# EAGLE schematic Eency -- HM-10_v01 (EAGLE 6.4)
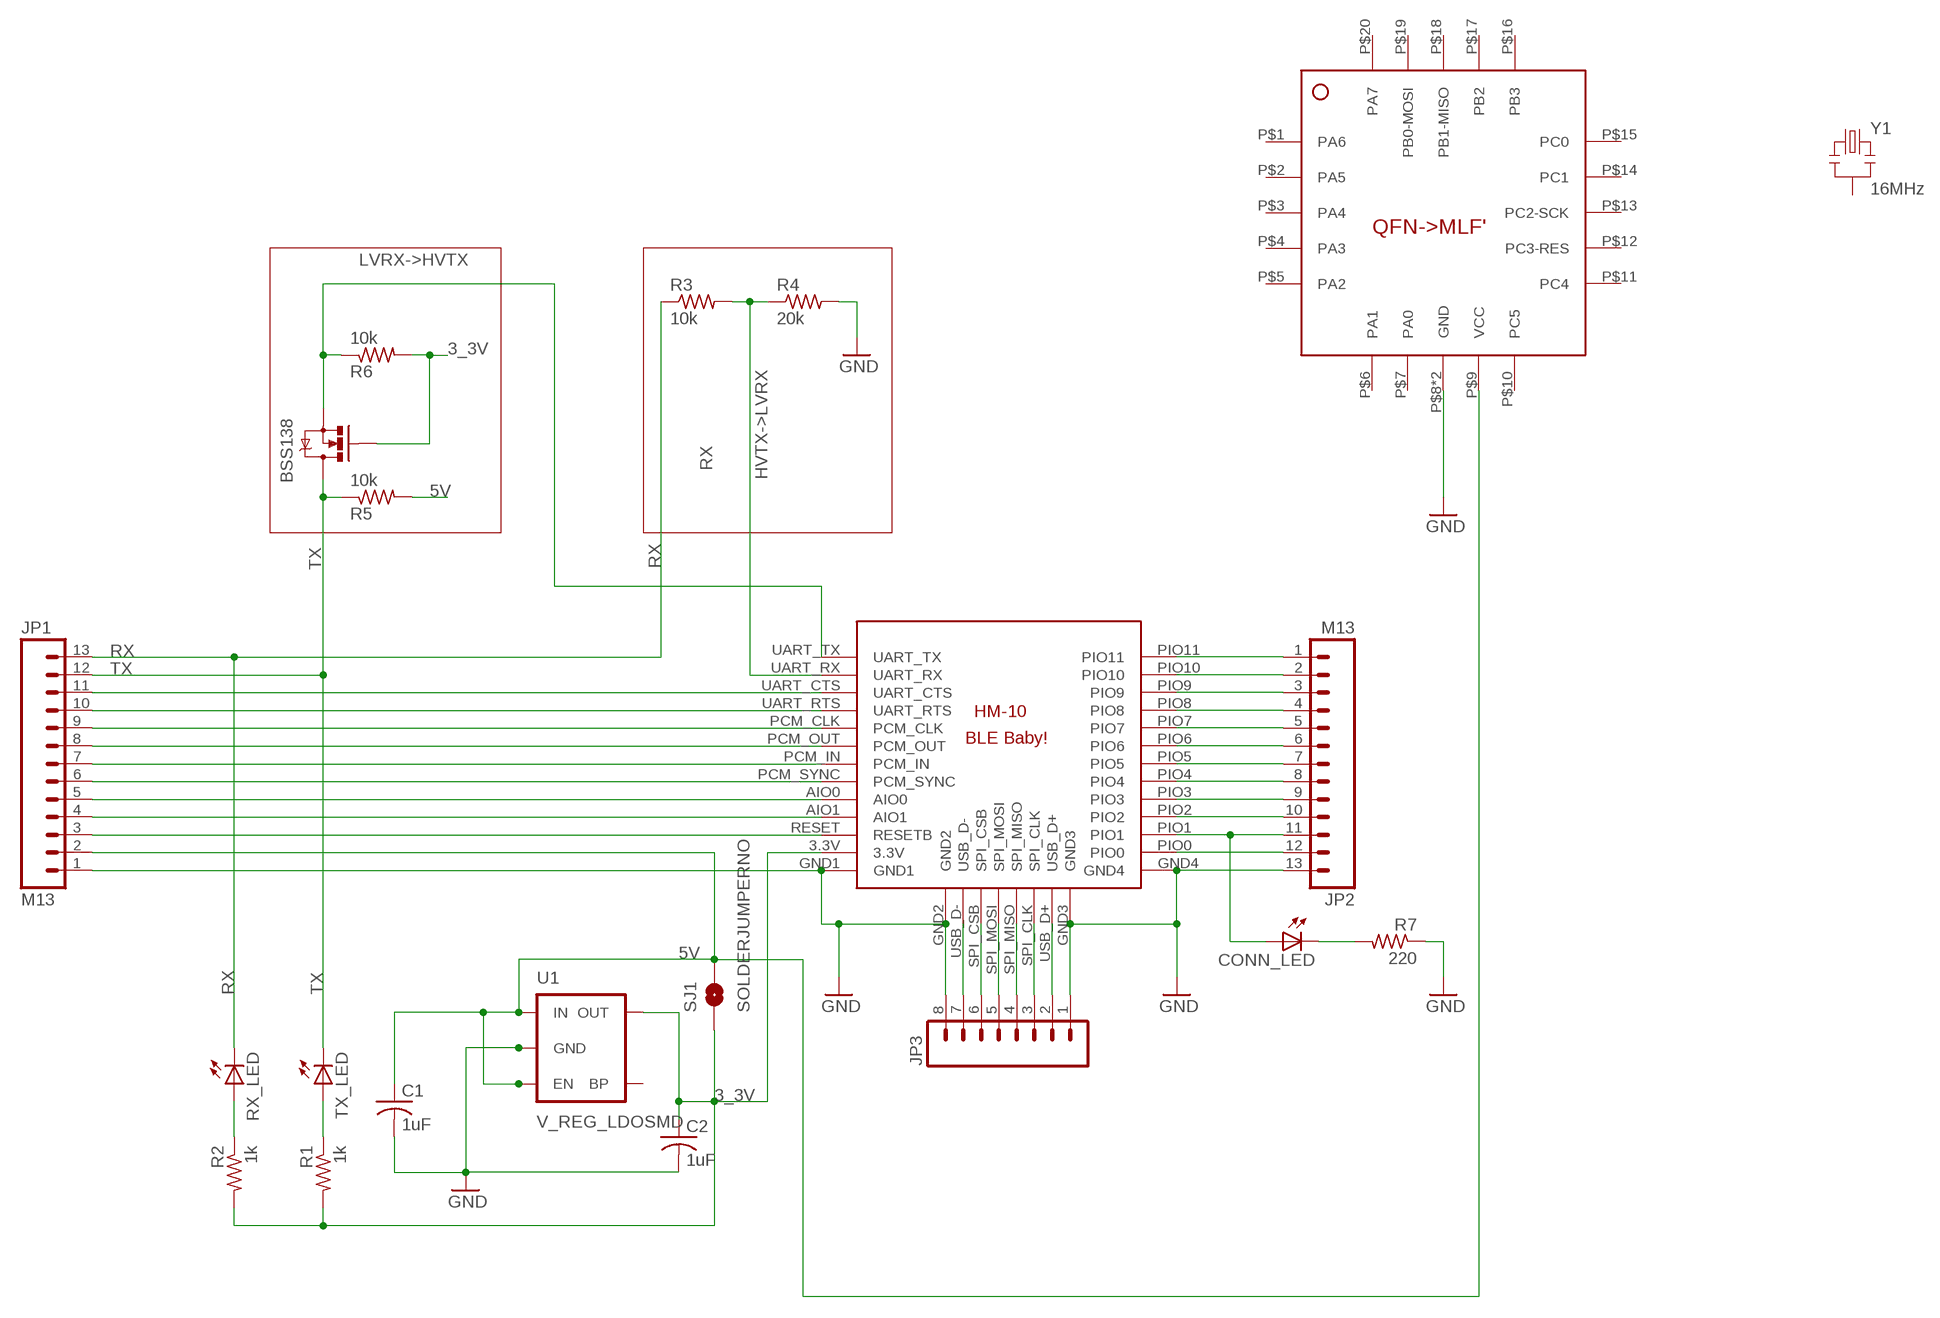
[diagram p0: schematic, sheet 1]

## Parts
BSS138  MOSFET-NCHANNELSMD  [SOT23-3]
C1  1uF  C-USC0805K  [C0805K]
C2  1uF  C-USC0805K  [C0805K]
CONN_LED  LED0603  [LED-0603]
JP1  M13  [1X13]
JP2  M13  [1X13]
JP3  M081X08  [1X08]
R1  1k  R-US_M0805  [M0805]
R2  1k  R-US_M0805  [M0805]
R3  10k  R-US_M0805  [M0805]
R4  20k  R-US_M0805  [M0805]
R5  10k  R-US_M0805  [M0805]
R6  10k  R-US_M0805  [M0805]
R7  220  R-US_M0805  [M0805]
RX_LED  LED0603  [LED-0603]
SJ1  SOLDERJUMPERNO  [SJ_2S-NO]
TX_LED  LED0603  [LED-0603]
U1  V_REG_LDOSMD  [SOT23-5]
U$1  BLE-HM-10  [BLE-HM-10]
U$4  AVR-5_ATTINY1634  [AVR-5_MLF20/ATTINY13]
Y1  16MHz  RESONATOR16MHZ  [RESONATOR-SMD]

## Nets
3_3V: BSS138.1(G) C2.1 R1.2 R2.2 R6.2 SJ1.1 U1.5(OUT) U$1.3.3V
5V: C1.1 JP1.2 R5.2 SJ1.2 U1.1(IN) U1.3(EN) U$4.P$9(VCC)
GND: C1.2 C2.2 JP1.1 JP2.13 JP3.1 JP3.8 R4.2 R7.1 U1.2(GND) U$1.GND1 U$1.GND2 U$1.GND3 U$1.GND4 U$4.P$8(GND) U$4.P$21(GND)
HVTX->LVRX: R3.2 R4.1 U$1.UART_RX
LVRX->HVTX: BSS138.2(S) R6.1 U$1.UART_TX
N$2: CONN_LED.A JP2.11 U$1.PIO1
N$3: JP1.3 U$1.RESET(RESETB)
N$4: JP1.4 U$1.AIO1
N$5: JP1.5 U$1.AIO0
N$6: JP1.6 U$1.PCM_SYNC
N$7: JP1.7 U$1.PCM_IN
N$8: JP1.8 U$1.PCM_OUT
N$9: JP1.9 U$1.PCM_CLK
N$10: JP1.10 U$1.UART_RTS
N$11: JP1.11 U$1.UART_CTS
N$14: JP2.1 U$1.PIO11
N$15: JP2.2 U$1.PIO10
N$16: JP2.3 U$1.PIO9
N$17: JP2.4 U$1.PIO8
N$18: JP2.5 U$1.PIO7
N$19: JP2.6 U$1.PIO6
N$20: JP2.7 U$1.PIO5
N$21: JP2.8 U$1.PIO4
N$22: JP2.9 U$1.PIO3
N$23: JP2.10 U$1.PIO2
N$24: R1.1 TX_LED.A
N$25: JP2.12 U$1.PIO0
N$26: CONN_LED.C R7.2
N$27: R2.1 RX_LED.A
N$28: JP3.2 U$1.USB_D+
N$29: JP3.3 U$1.SPI_CLK
N$30: JP3.4 U$1.SPI_MISO
N$31: JP3.5 U$1.SPI_MOSI
N$32: JP3.6 U$1.SPI_CSB
N$33: JP3.7 U$1.USB_D-
RX: JP1.13 R3.1 RX_LED.C
TX: BSS138.3(D) JP1.12 R5.1 TX_LED.C
Unconnected: U1.4(BP) U$4.P$1(PA6) U$4.P$2(PA5) U$4.P$3(PA4) U$4.P$4(PA3) U$4.P$5(PA2) U$4.P$6(PA1) U$4.P$7(PA0) U$4.P$10(PC5) U$4.P$11(PC4) U$4.P$12(PC3-RES) U$4.P$13(PC2-SCK) U$4.P$14(PC1) U$4.P$15(PC0) U$4.P$16(PB3) U$4.P$17(PB2) U$4.P$18(PB1-MISO) U$4.P$19(PB0-MOSI) U$4.P$20(PA7) Y1.1 Y1.2 Y1.3

## Library data of the parts
BSS138 = SparkFun:MOSFET-NCHANNEL
C1 C2 = resistor:C-US: CAPACITOR, American symbol
CONN_LED RX_LED TX_LED = SparkFun:LED: LEDs Standard schematic elements and footprints for 5mm, 3mm, 1206, and 0603 sized LEDs. 5mm - Spark Fun Electronics SKU : COM-00529 (and others)
JP1 JP2 = SparkFun:M13
JP3 = SparkFun:M08: Header 8 Standard 8-pin 0.1" header. Use with straight break away headers (SKU : PRT-00116), right angle break away headers (PRT-00553), swiss pins (PRT-00743), machine pins (PRT-00117), and female headers (PRT-00115).
R1-R7 = resistor:R-US_: RESISTOR, American symbol
SJ1 = SparkFun:SOLDERJUMPER: Solder Jumper Standard SMD solder jumper. Used to automate production. Two varients : Normally Open and Normally Closed are the same, but have different paste layers. NC will have a large amount of paste and should jumper during reflow.
U1 = SparkFun:V_REG_LDO: Voltage Regulator LDO Standard 150mA LDO voltage regulator in SOT-23 layout. Micrel part MIC5205. BP (by-pass) pin is used to lower output noise with 470pF cap.
U$1 = Random parts:BLE-HM-10
U$4 = Eency_v01:AVR-5_ATTINY1634
Y1 = SparkFun-FreqCtrl:RESONATOR: Resonator Small SMD resonator. Used, eg, on the Arduino Pro/ Pro Mini boards. 8MHz- XTAL-08895 16MHz- XTAL-08900; PROD_ID: XTAL-08900